# EAGLE schematic podstawa (EAGLE 8.6.3)
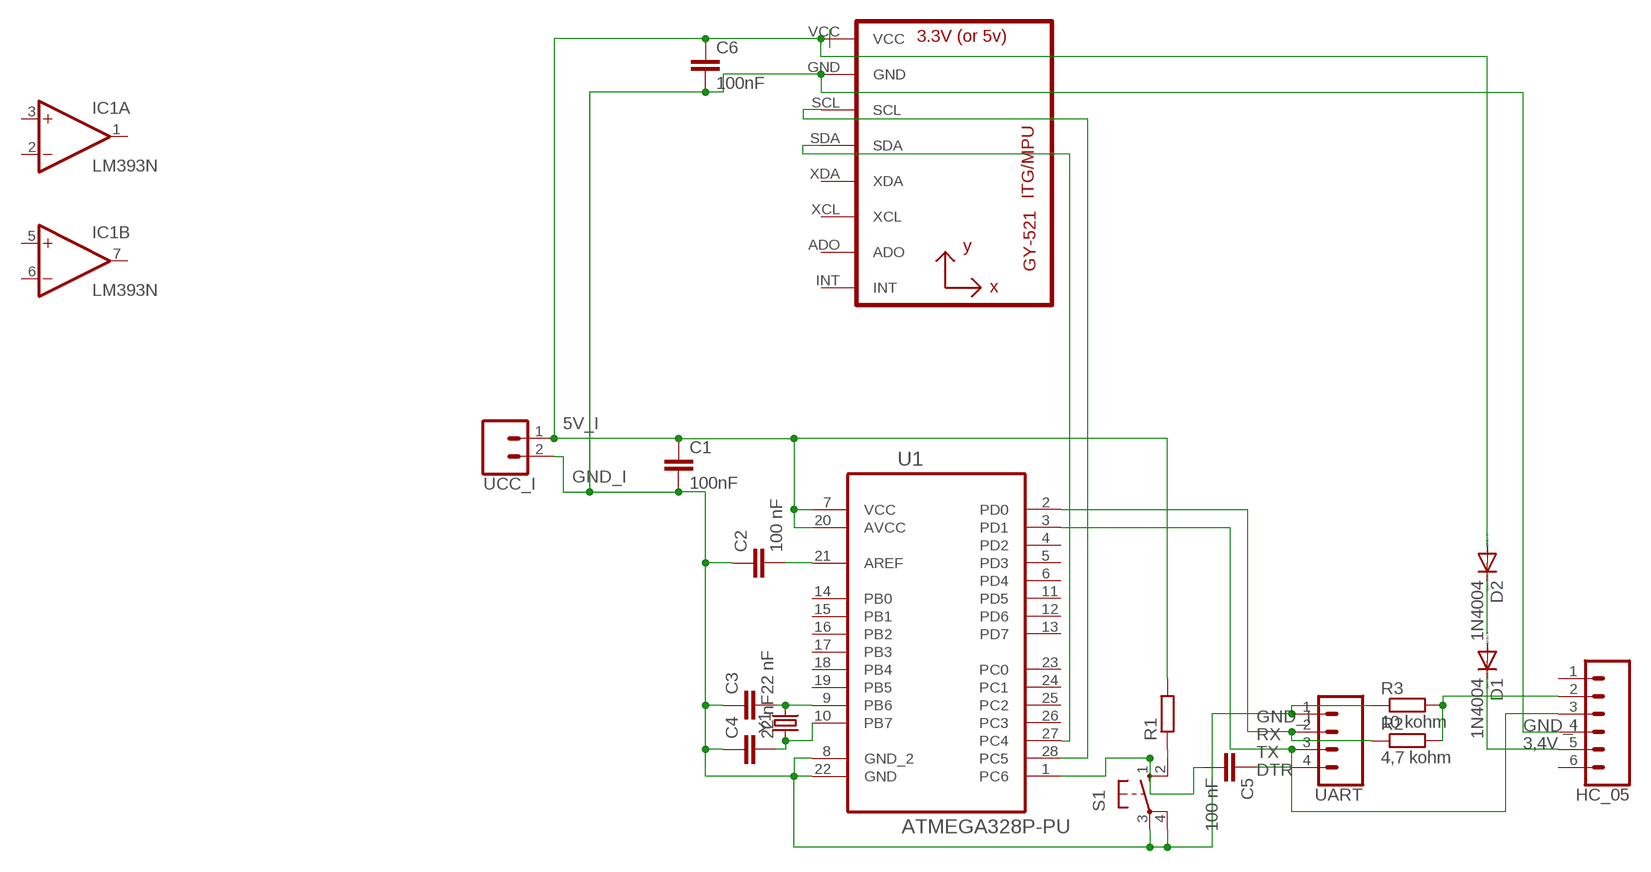
[diagram p0: schematic, sheet 1]

## Parts
C1  100nF  C-EU025-030X050  [C025-030X050]
C2  100 nF  C-EU025-030X050  [C025-030X050]
C3  22 nF  C-EU025-030X050  [C025-030X050]
C4  22 nF  C-EU025-030X050  [C025-030X050]
C5  100 nF  C-EU025-030X050  [C025-030X050]
C6  100nF  C-EU025-030X050  [C025-030X050]
D1  1N4004  [DO41-10]
D2  1N4004  [DO41-10]
HC_05  CONN_06LONGPADS  [1X06_LONGPADS]
IC1  LM393N  [DIL08]
R1  R-EU_0204/7  [0204/7]
R2  4,7 kohm  R-EU_0207/10  [0207/10]
R3  10 kohm  R-EU_0207/10  [0207/10]
S1  10-XX  [B3F-10XX]
U1  ATMEGA328P-PU  [DIP254P762X457-28]
U2  GY-521MPU6050  [GY-521]
UART  CONN_04LOCK_LONGPADS  [1X04_LOCK_LONGPADS]
UCC_I  CONN_02LOCK_LONGPADS  [1X02_LOCK_LONGPADS]
Y1  CRYSTALPTH-HC49US  [HC49US]

## Nets
3,4V: D1.C HC_05.5
5V_I: C1.1 C6.1 D2.A R1.2 U1.7(VCC) U1.20(AVCC) U2.VCC UCC_I.1
DTR: C5.1 UART.4
GND_I: C1.2 C2.1 C3.1 C4.1 C6.2 HC_05.4 R3.1 S1.3(P) S1.4(P1) U1.8(GND_2) U1.22(GND) U2.GND UART.1 UCC_I.2
N$1: C5.2 S1.1(S) U1.1(PC6)
N$2: R1.1 S1.2(S1)
N$3: C2.2 U1.21(AREF)
N$4: C3.2 U1.9(PB6) Y1.2
N$5: C4.2 U1.10(PB7) Y1.1
N$6: U1.27(PC4) U2.SDA
N$7: U1.28(PC5) U2.SCL
N$8: HC_05.2 R2.2 R3.2
N$9: D2.C
RX: R2.1 U1.2(PD0) UART.2
TX: HC_05.3 U1.3(PD1) UART.3
Unconnected: D1.A HC_05.1 HC_05.6 IC1.1(A:OUT) IC1.2(A:-IN) IC1.3(A:+IN) IC1.5(B:+IN) IC1.6(B:-IN) IC1.7(B:OUT) U1.4(PD2) U1.5(PD3) U1.6(PD4) U1.11(PD5) U1.12(PD6) U1.13(PD7) U1.14(PB0) U1.15(PB1) U1.16(PB2) U1.17(PB3) U1.18(PB4) U1.19(PB5) U1.23(PC0) U1.24(PC1) U1.25(PC2) U1.26(PC3) U2.ADO U2.INT U2.XCL U2.XDA

## Power pins joined to a net without a drawn wire
V+: IC1.8(P:V+)
V-: IC1.4(P:V-)

## Library data of the parts
C1-C6 = rcl:C-EU: CAPACITOR, European symbol; SPICEPREFIX: C
D1 D2 = diode:1N4004: DIODE general purpose rectifier, 1 A
HC_05 = SparkFun-Connectors:CONN_06: Multi connection point. Often used as Generic Header-pin footprint for 0.1 inch spaced/style header connections On any of the 0.1 inch spaced packages, you can populate with these: Break Away Headers - Straight <https://www.sparkfun.com/products/116> (PRT-00116) Break Away Male Headers - Right Angle <https://www.sparkfun.com/products/553> (PRT-00553) Female Headers <https://www.sparkfun.com/products/115> (PRT-00115) Break Away Headers - Machine Pin <https://www.sparkfun.com/products/117> (PRT-00117) Break Away Female Headers - Swiss Machine Pin <https://www.sparkfun.com/products/743> (PRT-00743) Arduino Stackable Header - 6 Pin <https://www.sparkfun.com/products/9280> (PRT-09280) For SCREWTERMINALS and SPRING TERMINALS visit here: Screw Terimnals on SparkFun.com <https://www.sparkfun.com/search/results?term=Screw+Terminals> (5mm/3.5mm/2.54mm spacing) This device is also useful as a general connection point to wire up your design to another part of your project. Our various solder wires solder well into these plated through hole pads. Hook-Up Wire - Assortment (Stranded, 22 AWG) <https://www.sparkfun.com/products/11375> (PRT-11375) Hook-Up Wire - Assortment (Solid Core, 22 AWG) <https://www.sparkfun.com/products/11367> (PRT-11367) View the entire wire category on our website here <https://www.sparkfun.com/categories/141>
IC1 = linear:LM393: COMPARATOR
R1-R3 = rcl:R-EU_: RESISTOR, European symbol; SPICEPREFIX: R
S1 = switch-omron:10-XX: OMRON SWITCH; MPN: B3F-1000; OC_FARNELL: 176432; OC_NEWARK: 36M3542
U1 = Atmel_By_element14_Batch_1-00:ATMEGA328P-PU: 8-bit Microcontroller with In-System Programmable Flash; MPN: ATMEGA328P-PU; OC_FARNELL: 1715487; OC_NEWARK: 15R0268; PACKAGE: PDIP-28; SUPPLIER: Atmel
U2 = gy-521:GY-521
UART = SparkFun-Connectors:CONN_04: Multi connection point. Often used as Generic Header-pin footprint for 0.1 inch spaced/style header connections On any of the 0.1 inch spaced packages, you can populate with these: Break Away Headers - Straight <https://www.sparkfun.com/products/116> (PRT-00116) Break Away Male Headers - Right Angle <https://www.sparkfun.com/products/553> (PRT-00553) Female Headers <https://www.sparkfun.com/products/115> (PRT-00115) Break Away Headers - Machine Pin <https://www.sparkfun.com/products/117> (PRT-00117) Break Away Female Headers - Swiss Machine Pin <https://www.sparkfun.com/products/743> (PRT-00743) For SCREWTERMINALS and SPRING TERMINALS visit here: Screw Terimnals on SparkFun.com <https://www.sparkfun.com/search/results?term=Screw+Terminals> (5mm/3.5mm/2.54mm spacing) This device is also useful as a general connection point to wire up your design to another part of your project. Our various solder wires solder well into these plated through hole pads. Hook-Up Wire - Assortment (Stranded, 22 AWG) <https://www.sparkfun.com/products/11375> (PRT-11375) Hook-Up Wire - Assortment (Solid Core, 22 AWG) <https://www.sparkfun.com/products/11367> (PRT-11367) View the entire wire category on our website here <https://www.sparkfun.com/categories/141> Special notes: Molex polarized connector foot print use with SKU : PRT-08231 with associated crimp pins and housings. 1MM SMD Version SKU: PRT-10208; PROD_ID: CONN-09696
UCC_I = SparkFun-Connectors:CONN_02: Multi connection point. Often used as Generic Header-pin footprint for 0.1 inch spaced/style header connections On any of the 0.1 inch spaced packages, you can populate with these: Break Away Headers - Straight <https://www.sparkfun.com/products/116> (PRT-00116) Break Away Male Headers - Right Angle <https://www.sparkfun.com/products/553> (PRT-00553) Female Headers <https://www.sparkfun.com/products/115> (PRT-00115) Break Away Headers - Machine Pin <https://www.sparkfun.com/products/117> (PRT-00117) Break Away Female Headers - Swiss Machine Pin <https://www.sparkfun.com/products/743> (PRT-00743) For SCREWTERMINALS and SPRING TERMINALS visit here: Screw Terimnals on SparkFun.com <https://www.sparkfun.com/search/results?term=Screw+Terminals> (5mm/3.5mm/2.54mm spacing) This device is also useful as a general connection point to wire up your design to another part of your project. Our various solder wires solder well into these plated through hole pads. Hook-Up Wire - Assortment (Stranded, 22 AWG) <https://www.sparkfun.com/products/11375> (PRT-11375) Hook-Up Wire - Assortment (Solid Core, 22 AWG) <https://www.sparkfun.com/products/11367> (PRT-11367) View the entire wire category on our website here <https://www.sparkfun.com/categories/141> Special notes: Molex polarized connector foot print use with: PRT-08233 with associated crimp pins and housings. 2.54_SCREWTERM for use with PRT-10571. 3.5mm Screw Terminal footprints for PRT-08084 5mm Screw Terminal footprints for use with PRT-08432
Y1 = SparkFun-Clocks:CRYSTAL: Crystals (Generic) These are passive quartz crystals, which can be used as a clock source for a microcontroller. Crystal's are two-terminal devices. They require external "load" capacitors to generate an oscillating signal.